# EAGLE schematic max1708circ (EAGLE 7.2.0)
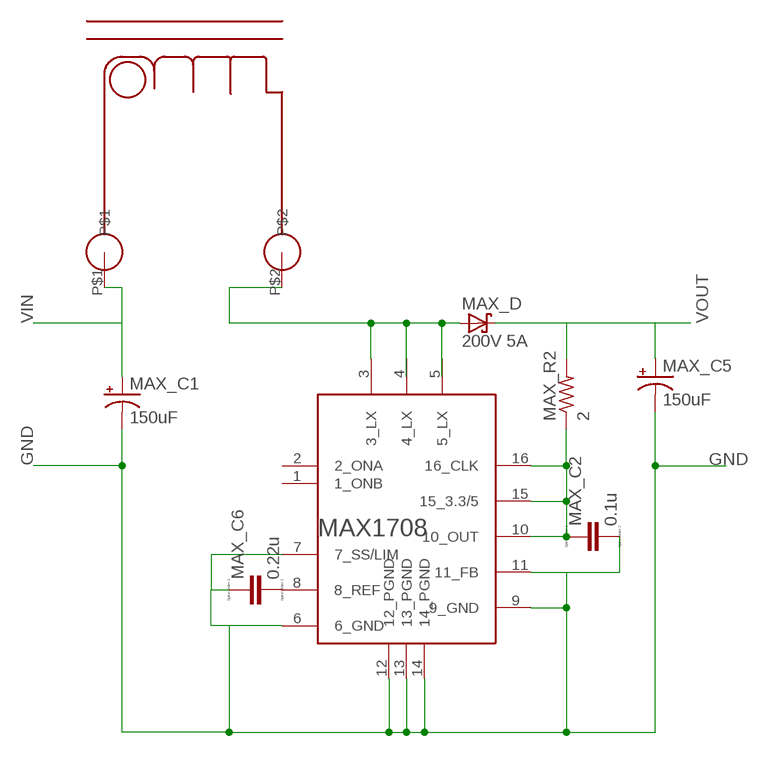
[diagram p0: schematic, sheet 1]

## Parts
MAX_C1  150uF  CPOL-USD/7343-31W  [D/7343-31W]
MAX_C2  0.1u  CC1206  [C1206]
MAX_C5  150uF  CPOL-USD/7343-31W  [D/7343-31W]
MAX_C6  0.22u  CC1206  [C1206]
MAX_D  200V 5A  SCHOTTKY-DIODESMC  [SMC]
MAX_R2  2  R-US_R1206  [R1206]
U$1  MAX1708  [QSOP16]
U$2  UP2B-2R2-R  [UP2B-2R2-R]

## Nets
GND: MAX_C1.- MAX_C2.2 MAX_C5.- MAX_C6.1 U$1.6(6_GND) U$1.7(7_SS/LIM) U$1.9(9_GND) U$1.11(11_FB) U$1.12(12_PGND) U$1.13(13_PGND) U$1.14(14_PGND)
N$1: MAX_C5.+
N$2: MAX_D.A U$1.3(3_LX) U$2.P$2
N$3: MAX_C2.1 MAX_R2.1 U$1.10(10_OUT) U$1.15(15_3.3/5) U$1.16(16_CLK)
N$4: MAX_C6.2 U$1.8(8_REF)
VIN: MAX_C1.+ U$2.P$1
VOUT: MAX_D.C MAX_R2.2
Unconnected: U$1.1(1_ONB) U$1.2(2_ONA) U$1.4(4_LX) U$1.5(5_LX)

## Library data of the parts
MAX_C1 MAX_C5 = adafruit:CPOL-US: POLARIZED CAPACITOR, American symbol
MAX_C2 MAX_C6 = eagle-ltspice:C: CAPACITOR, European symbol; SPICEMODEL: NONE; SPICEPREFIX: C
MAX_D = diode:SCHOTTKY-DIODE: Schottky Diode
MAX_R2 = adafruit:R-US_: RESISTOR, American symbol
U$1 = max1708:MAX1708
U$2 = fuelgauge:UP2B-2R2-R: Yeah yeah inducktor